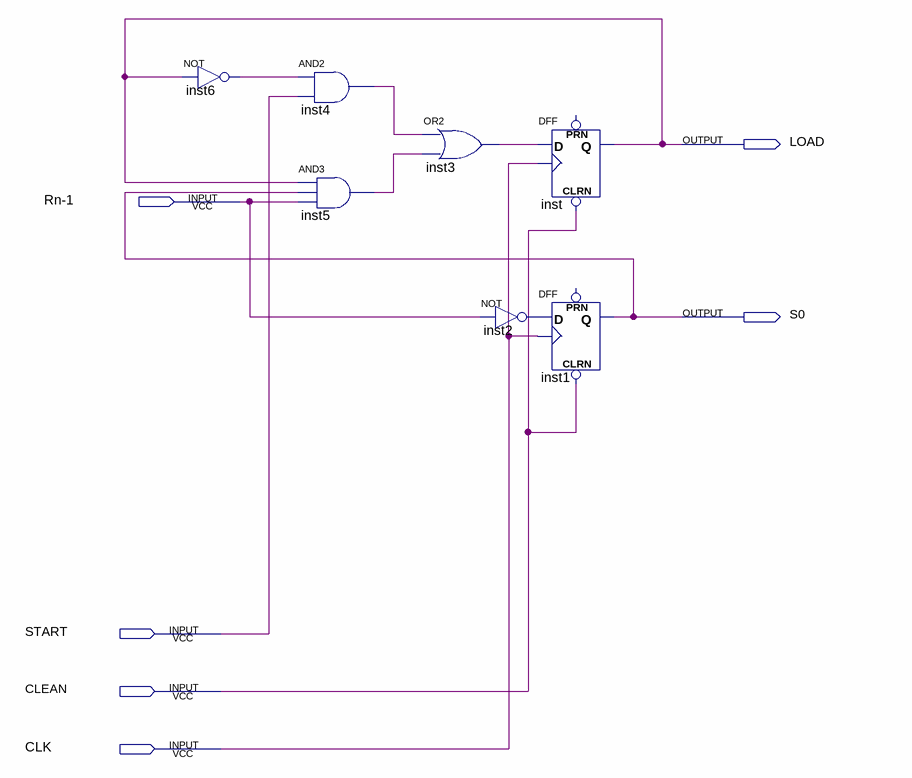
[diagram p0: schematic sheet]
// Quartus schematic control.bdf as structural Verilog: 7 symbols, 6 pins
module control (
  input  \Rn-1 ,
  input  START,
  input  CLEAN,
  input  CLK,
  output LOAD,
  output S0
);

  wire inst2_out, inst3_out, inst4_out, inst5_out, inst6_out;

  not inst6 (inst6_out, LOAD);
  and inst4 (inst4_out, inst6_out, START);
  and inst5 (inst5_out, LOAD, S0, \Rn-1 );
  or inst3 (inst3_out, inst4_out, inst5_out);
  not inst2 (inst2_out, \Rn-1 );
  DFF inst (.CLRN(CLEAN), .CLK(CLK), .D(inst3_out), .Q(LOAD));  // open: PRN
  DFF inst1 (.CLRN(CLEAN), .CLK(CLK), .D(inst2_out), .Q(S0));  // open: PRN
endmodule
